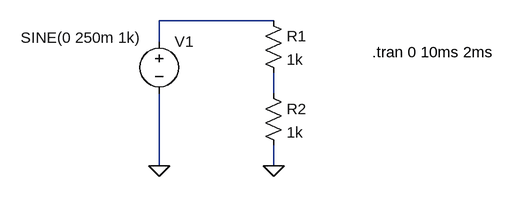
[diagram p0: schematic 01-DivRes.asc]
01-DivRes.asc, the LTspice schematic file:
Version 4
SHEET 1 880 680
WIRE 288 112 112 112
WIRE 112 144 112 112
WIRE 288 224 288 192
WIRE 112 336 112 224
WIRE 288 336 288 304
FLAG 112 336 0
FLAG 288 336 0
SYMBOL voltage 112 128 R0
WINDOW 3 -213 10 Left 2
WINDOW 123 0 0 Left 0
WINDOW 39 0 0 Left 0
SYMATTR InstName V1
SYMATTR Value SINE(0 250m 1k)
SYMBOL res 272 96 R0
SYMATTR InstName R1
SYMATTR Value 1k
SYMBOL res 272 208 R0
SYMATTR InstName R2
SYMATTR Value 1k
TEXT 440 160 Left 2 !.tran 0 10ms 2ms

The netlist it stands for:
* 01-DivRes.asc
V1 N001 0 SINE(0 250m 1k)
R1 N001 N002 1k
R2 N002 0 1k
.tran 0 10ms 2ms
.backanno
.end